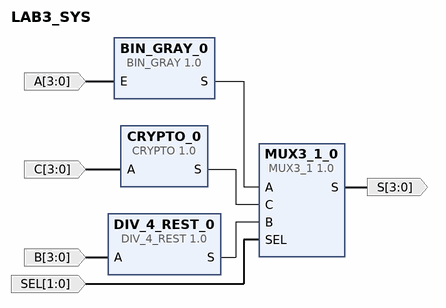
[diagram p0: block diagram of the top level]
# Vivado block design LAB3_SYS, xc7a100tcsg324-1, Vivado 2020.1
create_bd_design LAB3_SYS

create_bd_port -dir I -from 3 -to 0 A
create_bd_port -dir I -from 3 -to 0 B
create_bd_port -dir I -from 3 -to 0 C
create_bd_port -dir I -from 1 -to 0 SEL
create_bd_port -dir O -from 3 -to 0 S

create_bd_cell -type ip -vlnv xilinx.com:user:BIN_GRAY:1.0 BIN_GRAY_0
create_bd_cell -type ip -vlnv xilinx.com:user:DIV_4_REST:1.0 DIV_4_REST_0
create_bd_cell -type ip -vlnv xilinx.com:user:CRYPTO:1.0 CRYPTO_0
create_bd_cell -type ip -vlnv xilinx.com:user:MUX3_1:1.0 MUX3_1_0

# ---- connections ----

connect_bd_net [get_bd_pins MUX3_1_0/S] [get_bd_ports S]
connect_bd_net [get_bd_ports A] [get_bd_pins BIN_GRAY_0/E]
connect_bd_net [get_bd_ports B] [get_bd_pins DIV_4_REST_0/A]
connect_bd_net [get_bd_ports C] [get_bd_pins CRYPTO_0/A]
connect_bd_net [get_bd_ports SEL] [get_bd_pins MUX3_1_0/SEL]
connect_bd_net [get_bd_pins BIN_GRAY_0/S] [get_bd_pins MUX3_1_0/A]
connect_bd_net [get_bd_pins DIV_4_REST_0/S] [get_bd_pins MUX3_1_0/B]
connect_bd_net [get_bd_pins CRYPTO_0/S] [get_bd_pins MUX3_1_0/C]

validate_bd_design
save_bd_design
